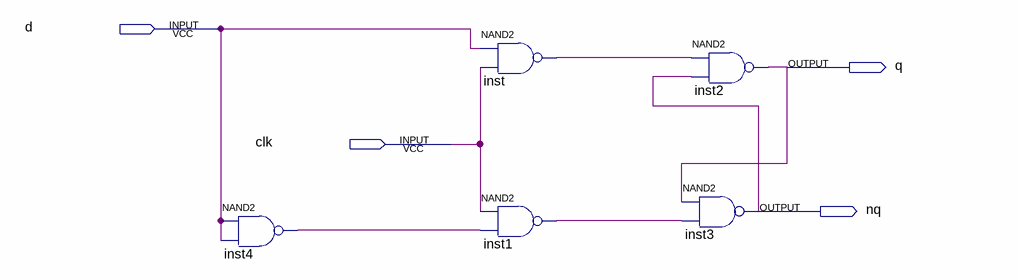
[diagram p0: schematic sheet]
// Quartus schematic lab9a.bdf as structural Verilog: 5 symbols, 4 pins
module lab9a (
  input  d,
  input  clk,
  output q,
  output nq
);

  wire inst1_out, inst4_out, inst_out;

  nand inst4 (inst4_out, d, d);
  nand inst (inst_out, d, clk);
  nand inst1 (inst1_out, clk, inst4_out);
  nand inst2 (q, inst_out, nq);
  nand inst3 (nq, q, inst1_out);
endmodule
